# EAGLE design 5i20-xylotex-c (EAGLE 4.16)
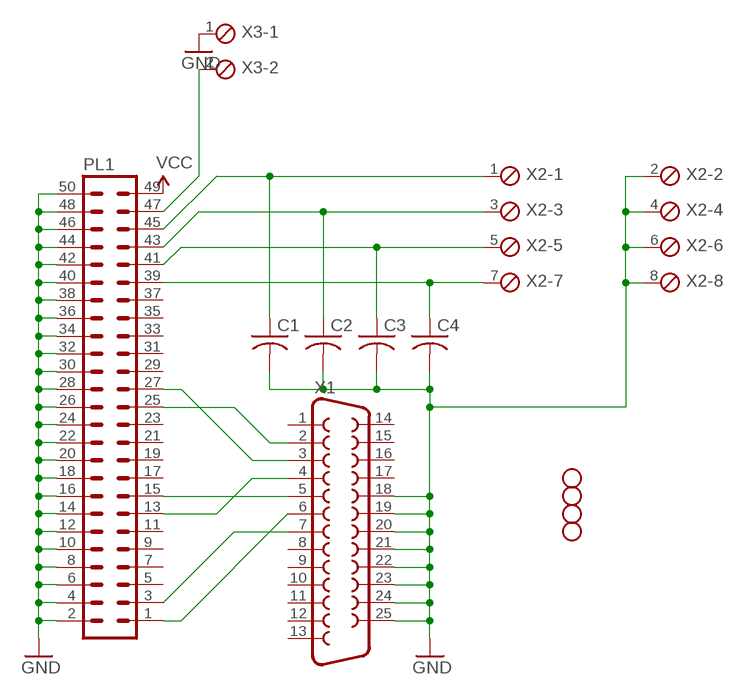
[diagram p0: schematic, sheet 1]

## Parts
C1  C-US025-025X050  [C025-025X050]
C2  C-US025-025X050  [C025-025X050]
C3  C-US025-025X050  [C025-025X050]
C4  C-US025-025X050  [C025-025X050]
PL1  50V  [50V]
U$1  STAND-OFF  [STAND-OFF]
U$2  STAND-OFF  [STAND-OFF]
U$3  STAND-OFF  [STAND-OFF]
U$4  STAND-OFF  [STAND-OFF]
X1  F25HP  [F25HP]
X2  MPT8  [8POL254]
X3  MPT2  [2POL254]

## Nets
GND: C1.2 C2.2 C3.2 C4.2 PL1.2 PL1.4 PL1.6 PL1.8 PL1.10 PL1.12 PL1.14 PL1.16 PL1.18 PL1.20 PL1.22 PL1.24 PL1.26 PL1.28 PL1.30 PL1.32 PL1.34 PL1.36 PL1.38 PL1.40 PL1.42 PL1.44 PL1.46 PL1.48 PL1.50 X1.18 X1.19 X1.20 X1.21 X1.22 X1.23 X1.24 X1.25 X2.2 X2.4 X2.6 X2.8 X3.1
N$1: PL1.25 X1.2
N$2: PL1.27 X1.3
N$3: PL1.13 X1.4
N$4: PL1.15 X1.5
N$5: PL1.1 X1.6
N$6: PL1.3 X1.7
N$7: C1.1 PL1.45 X2.1
N$8: C2.1 PL1.43 X2.3
N$9: C3.1 PL1.41 X2.5
N$10: C4.1 PL1.39 X2.7
N$11: PL1.47 X3.2
VCC: PL1.49
Unconnected: PL1.5 PL1.7 PL1.9 PL1.11 PL1.17 PL1.19 PL1.21 PL1.23 PL1.29 PL1.31 PL1.33 PL1.35 PL1.37 X1.1 X1.8 X1.9 X1.10 X1.11 X1.12 X1.13 X1.14 X1.15 X1.16 X1.17

## Library data of the parts
C1-C4 = rcl:C-US: CAPACITOR, American symbol
PL1 = con-harting-v:50V: CONNECTOR
U$1-U$4 = SparkFun:STAND-OFF: Stand Off This is the mechanical footprint for a #4 phillips button head screw. Use the keepout ring to avoid running the screw head into surrounding components. SKU : PRT-00447
X1 = SparkFun:F25: D-SUB 25 25 Pin male connector. PCB edge mount for regular PCB thicknesses. This connector will connect directly to the back of a PC parallel port or through a normal DB25 extension cable (M/F). SKU: PRT-08287
X2 = con-phoenix-254:MPT8: PHOENIX CONNECTOR
X3 = con-phoenix-254:MPT2: PHOENIX CONNECTOR

## Net classes
0 default: width 0.356 mm, drill 0.33 mm

## Board
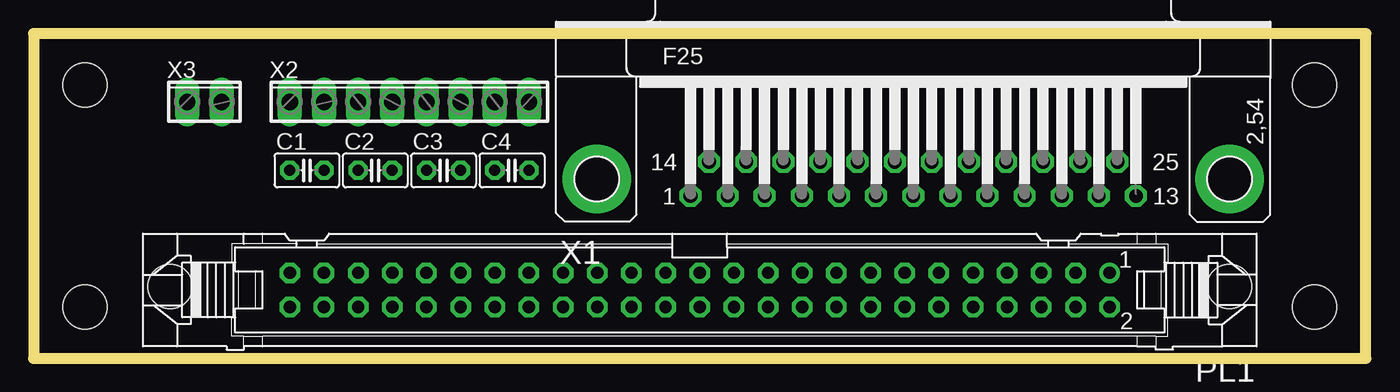
[diagram p1: board, top side]
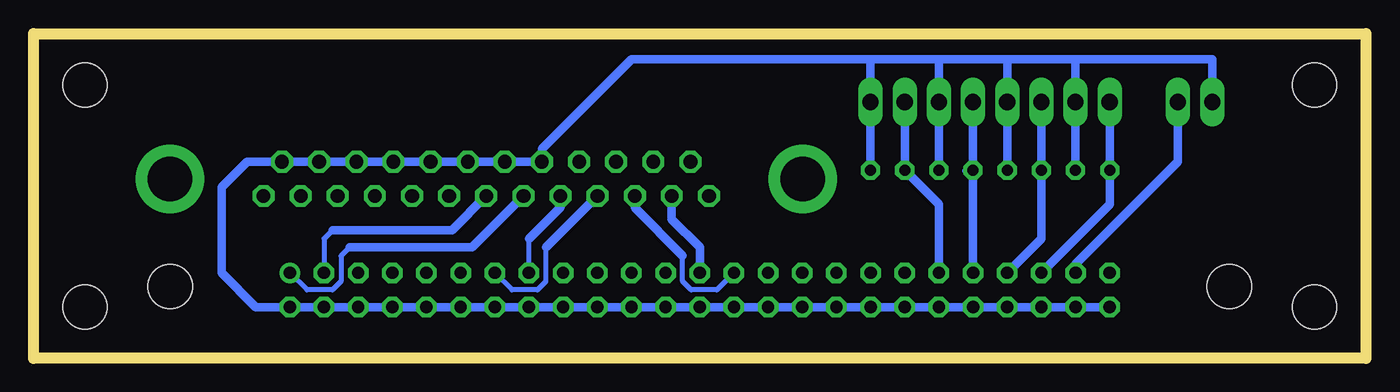
[diagram p2: board, bottom side, seen from below]

Size 99.06 x 24.13 mm. Coordinates in mm from the lower left corner, seen from the top.
Outline: 0,0 99.06,0 99.06,24.13 0,24.13 0,0
Copper layers (1*16): Top 0.035mm / dielectric 1.5mm / Bottom 0.035mm
Design rules "default": minimum track width 10mil, minimum drill 27mil, track to track 8mil, track to pad 8mil, pad to pad 8mil, via to via 8mil, smd to smd 8mil, copper to edge 4mil, drill to drill 8mil, minimum pad ring 12mil, minimum via ring 8mil, stop-mask expansion 4mil, vias tented up to drill 0mil, thermal gap 10mil
bRestrict: 6 lines

### Footprints (pad centres in the part's own frame; a part is rotated, then mirrored left to right if it is on the bottom)
C025-025X050 = drill 0.813 octagon: 1 -1.27,0; 2 1.27,0
50V = drill 0.914 round: 1 -30.48,-1.27 | drill 0.914 octagon: 2 -30.48,1.27; 3 -27.94,-1.27; 4 -27.94,1.27; 5 -25.4,-1.27; 6 -25.4,1.27; 7 -22.86,-1.27; 8 -22.86,1.27; 9 -20.32,-1.27; 10 -20.32,1.27; 11 -17.78,-1.27; 12 -17.78,1.27; 13 -15.24,-1.27; 14 -15.24,1.27; 15 -12.7,-1.27; 16 -12.7,1.27; 17 -10.16,-1.27; 18 -10.16,1.27; 19 -7.62,-1.27; 20 -7.62,1.27; 21 -5.08,-1.27; 22 -5.08,1.27; 23 -2.54,-1.27; 24 -2.54,1.27; 25 0,-1.27; 26 0,1.27; 27 2.54,-1.27; 28 2.54,1.27; 29 5.08,-1.27; 30 5.08,1.27; 31 7.62,-1.27; 32 7.62,1.27; 33 10.16,-1.27; 34 10.16,1.27; 35 12.7,-1.27; 36 12.7,1.27; 37 15.24,-1.27; 38 15.24,1.27; 39 17.78,-1.27; 40 17.78,1.27; 41 20.32,-1.27; 42 20.32,1.27; 43 22.86,-1.27; 44 22.86,1.27; 45 25.4,-1.27; 46 25.4,1.27; 47 27.94,-1.27; 48 27.94,1.27; 49 30.48,-1.27; 50 30.48,1.27 | hole 3.302: 39.37,-0.254; -39.37,-0.254
STAND-OFF = hole 3.302: 0,0
F25HP = drill 1.016 octagon: 1 -16.561,-1.27; 2 -13.792,-1.27; 3 -11.049,-1.27; 4 -8.28,-1.27; 5 -5.512,-1.27; 6 -2.769,-1.27; 7 0,-1.27; 8 2.769,-1.27; 9 5.512,-1.27; 10 8.28,-1.27; 11 11.049,-1.27; 12 13.792,-1.27; 13 16.561,-1.27; 14 -15.189,1.27; 15 -12.421,1.27; 16 -9.652,1.27; 17 -6.909,1.27; 18 -4.14,1.27; 19 -1.372,1.27; 20 1.372,1.27; 21 4.14,1.27; 22 6.909,1.27; 23 9.652,1.27; 24 12.421,1.27; 25 15.189,1.27 | drill 3.302 pad 5.08 round: G1 -23.52,0; G2 23.52,0
8POL254 = drill 1.2 long: 1 -8.89,0; 2 -6.35,0; 3 -3.81,0; 4 -1.27,0; 5 1.27,0; 6 3.81,0; 7 6.35,0; 8 8.89,0
2POL254 = drill 1.2 long: 1 -1.27,0; 2 1.27,0

### Placement (x,y rotation side)
C1  20.32,13.97 0 top
C2  25.4,13.97 0 top
C3  30.48,13.97 0 top
C4  35.56,13.97 0 top
PL1  49.53,5.08 180 top
U$1  3.81,3.81 0 top
U$2  3.81,20.32 0 top
U$3  95.25,20.32 0 top
U$4  95.25,3.81 0 top
X1  65.41,13.34 0 top
X2  27.94,19.05 0 top
X3  12.7,19.05 0 top

### Tracks (layer width: path | path; a pad name or v marks a point on that pad's centre or on a via)
GND
  Bottom 0.632: PL1.50 PL1.48 PL1.46 PL1.44 PL1.42 PL1.40 PL1.38 PL1.36 PL1.34 PL1.32 PL1.30 PL1.28 PL1.26 PL1.24 PL1.22 PL1.20 PL1.18 PL1.16 PL1.14 PL1.12 PL1.10 PL1.8 PL1.6 PL1.4 | PL1.4 PL1.2 | PL1.4 82.55,3.81 85.09,6.35 85.09,12.7 83.19,14.61 X1.25 X1.24 X1.23 X1.22 X1.21 X1.20 64.14,14.61 | 26.67,22.23 21.59,22.23 X2.2 C1.2 | 26.67,22.23 X2.4 C2.2 | 36.83,22.23 X2.8 C4.2 | 31.75,22.23 26.67,22.23 | 36.83,22.23 31.75,22.23 | 31.75,22.23 X2.6 C3.2 | 36.83,22.23 54.61,22.23 61.26,15.57 X1.18 64.14,14.61 | 64.14,14.61 X1.19
  Bottom 0.635: X3.1 11.43,22.23 21.59,22.23
N$1
  Bottom 0.635: X1.2 51.61,10.34 49.53,8.26 PL1.25
N$2
  Bottom 0.356: PL1.27 48.26,5.08 50.16,5.08 50.8,5.71 50.8,7.62
  Bottom 0.635: X1.3 54.36,11.18 50.8,7.62
N$3
  Bottom 0.356: 57.12,12.09 X1.4 | 60.96,8.26 60.96,5.71 61.59,5.08 63.5,5.08 PL1.13
  Bottom 0.635: 60.96,8.26 57.12,12.09
N$4
  Bottom 0.356: 59.89,11.23 X1.5 | PL1.15 62.23,8.89
  Bottom 0.635: 62.23,8.89 59.89,11.23
N$5
  Bottom 0.356: PL1.1 78.74,5.08 76.84,5.08 76.2,5.71 76.2,7.62 75.56,8.26
  Bottom 0.635: X1.6 66.45,8.26 75.56,8.26
N$6
  Bottom 0.356: 76.84,9.53 77.47,8.89 PL1.3
  Bottom 0.635: X1.7 67.95,9.53 76.84,9.53
N$7
  Bottom 0.635: PL1.45 19.05,11.43 C1.1 X2.1
N$8
  Bottom 0.635: PL1.43 24.13,8.89 C2.1 X2.3
N$9
  Bottom 0.356: 29.21,13.34 29.84,13.97 C3.1
  Bottom 0.635: PL1.41 29.21,13.34 | C3.1 X2.5
N$10
  Bottom 0.635: PL1.39 31.75,11.43 C4.1 X2.7
N$11
  Bottom 0.356: PL1.47 21.59,6.99
  Bottom 0.635: 21.59,6.99 13.97,14.61 X3.2